# EasyEDA Pro project ProPrj_智能视觉集成板-V2.0.epro, board 母板
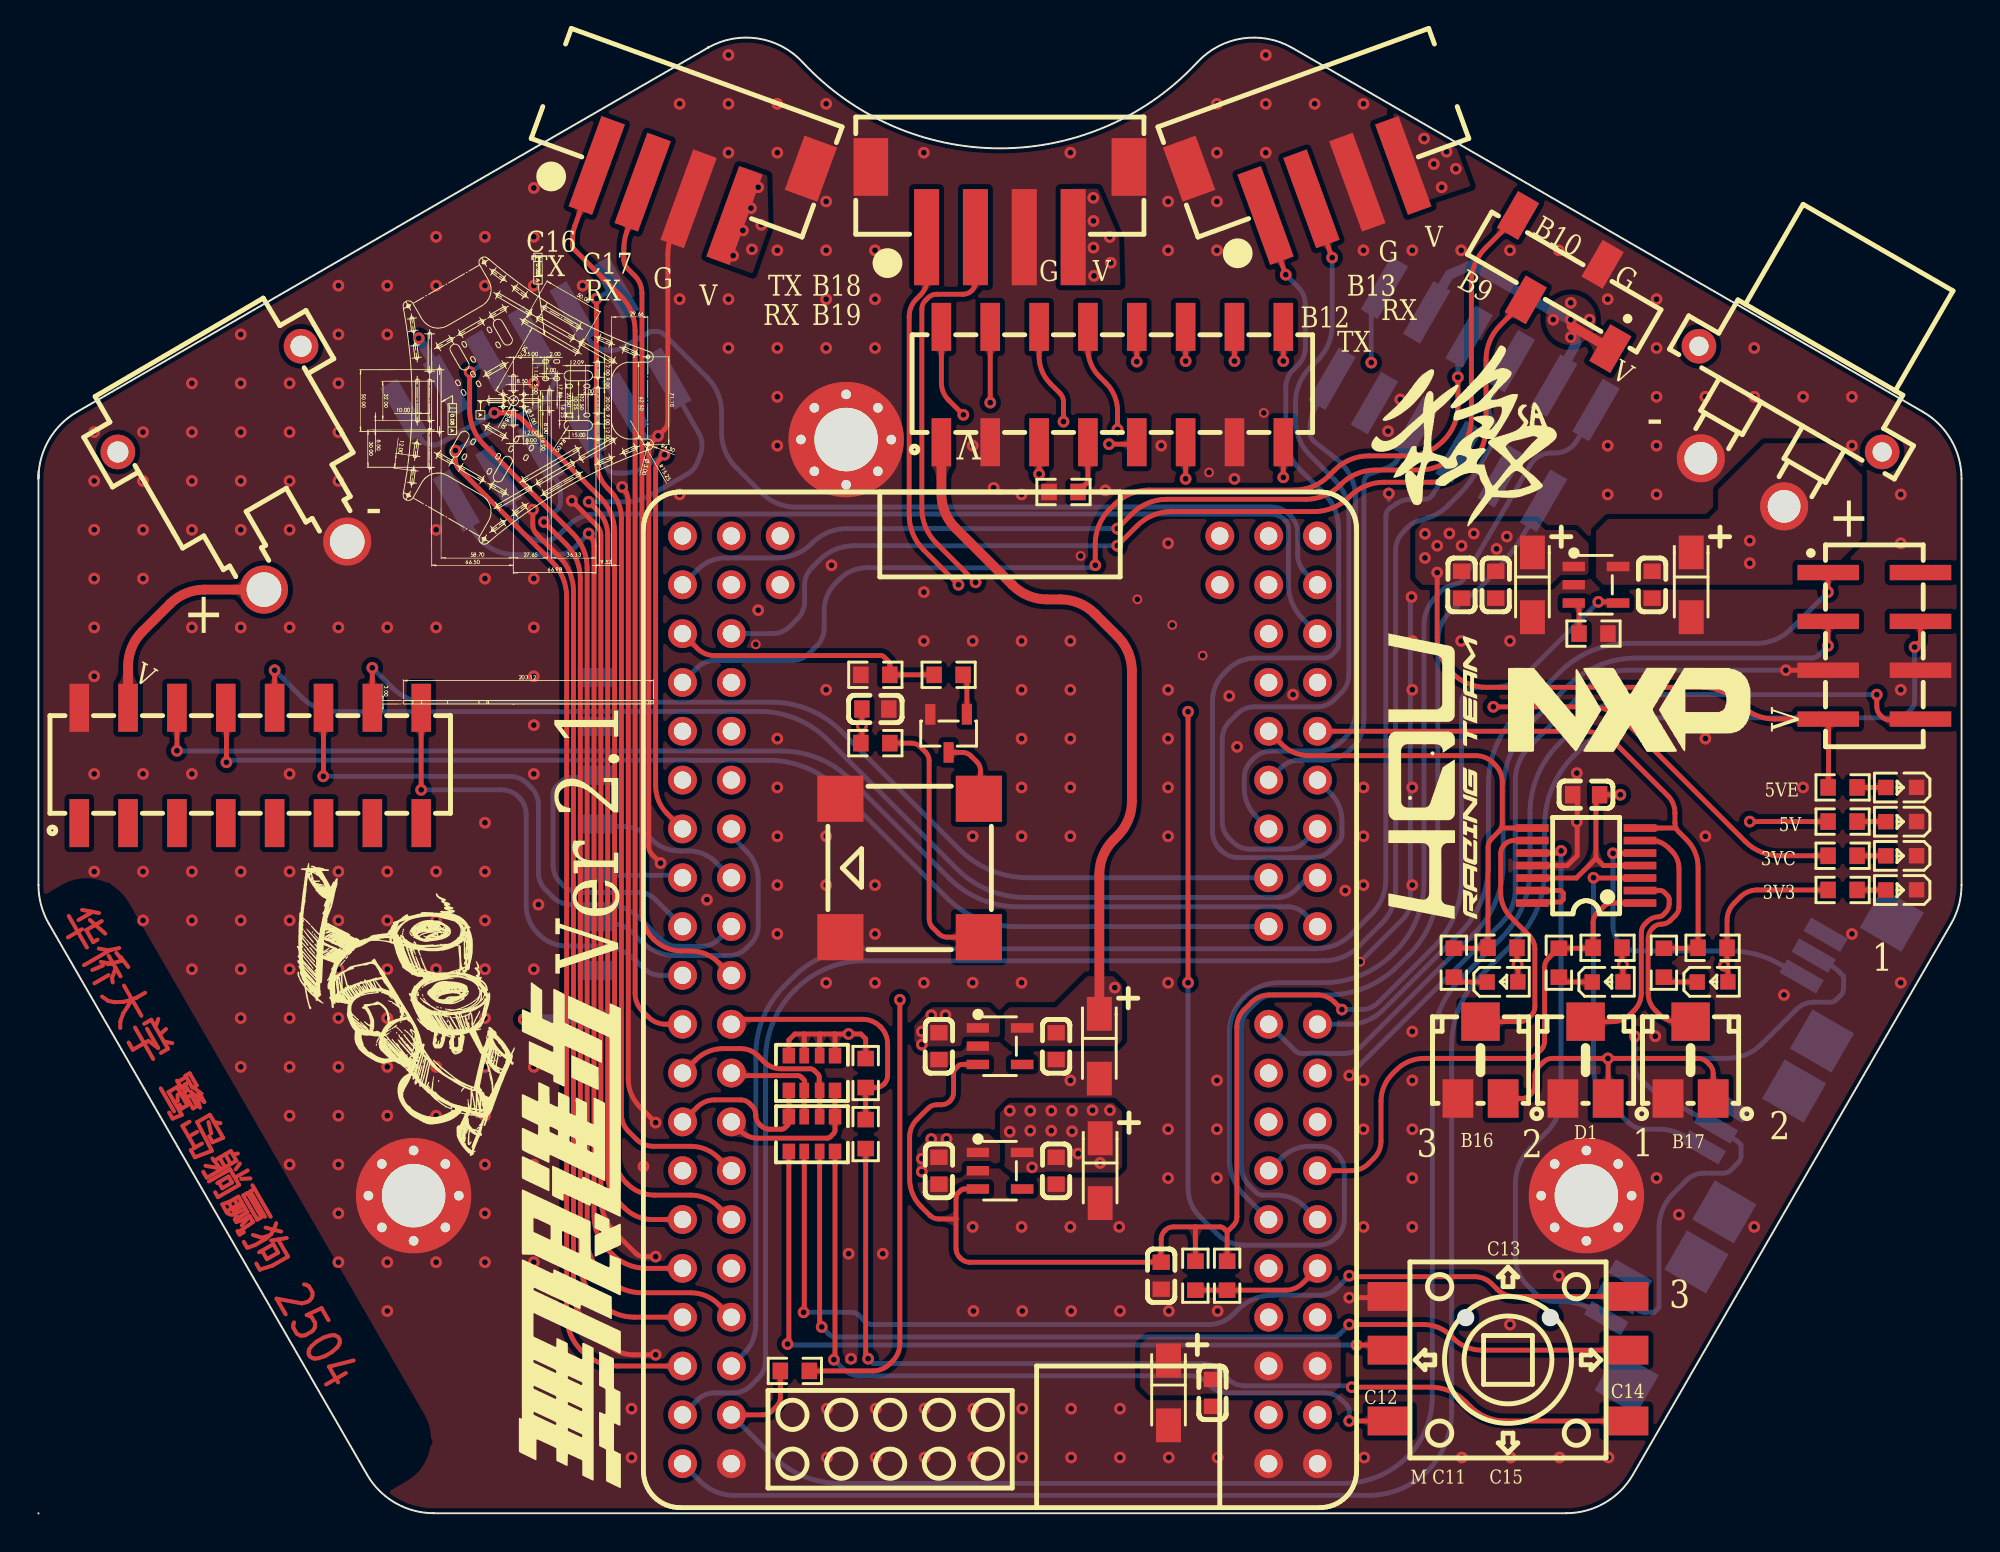
[diagram p17: board, top side]
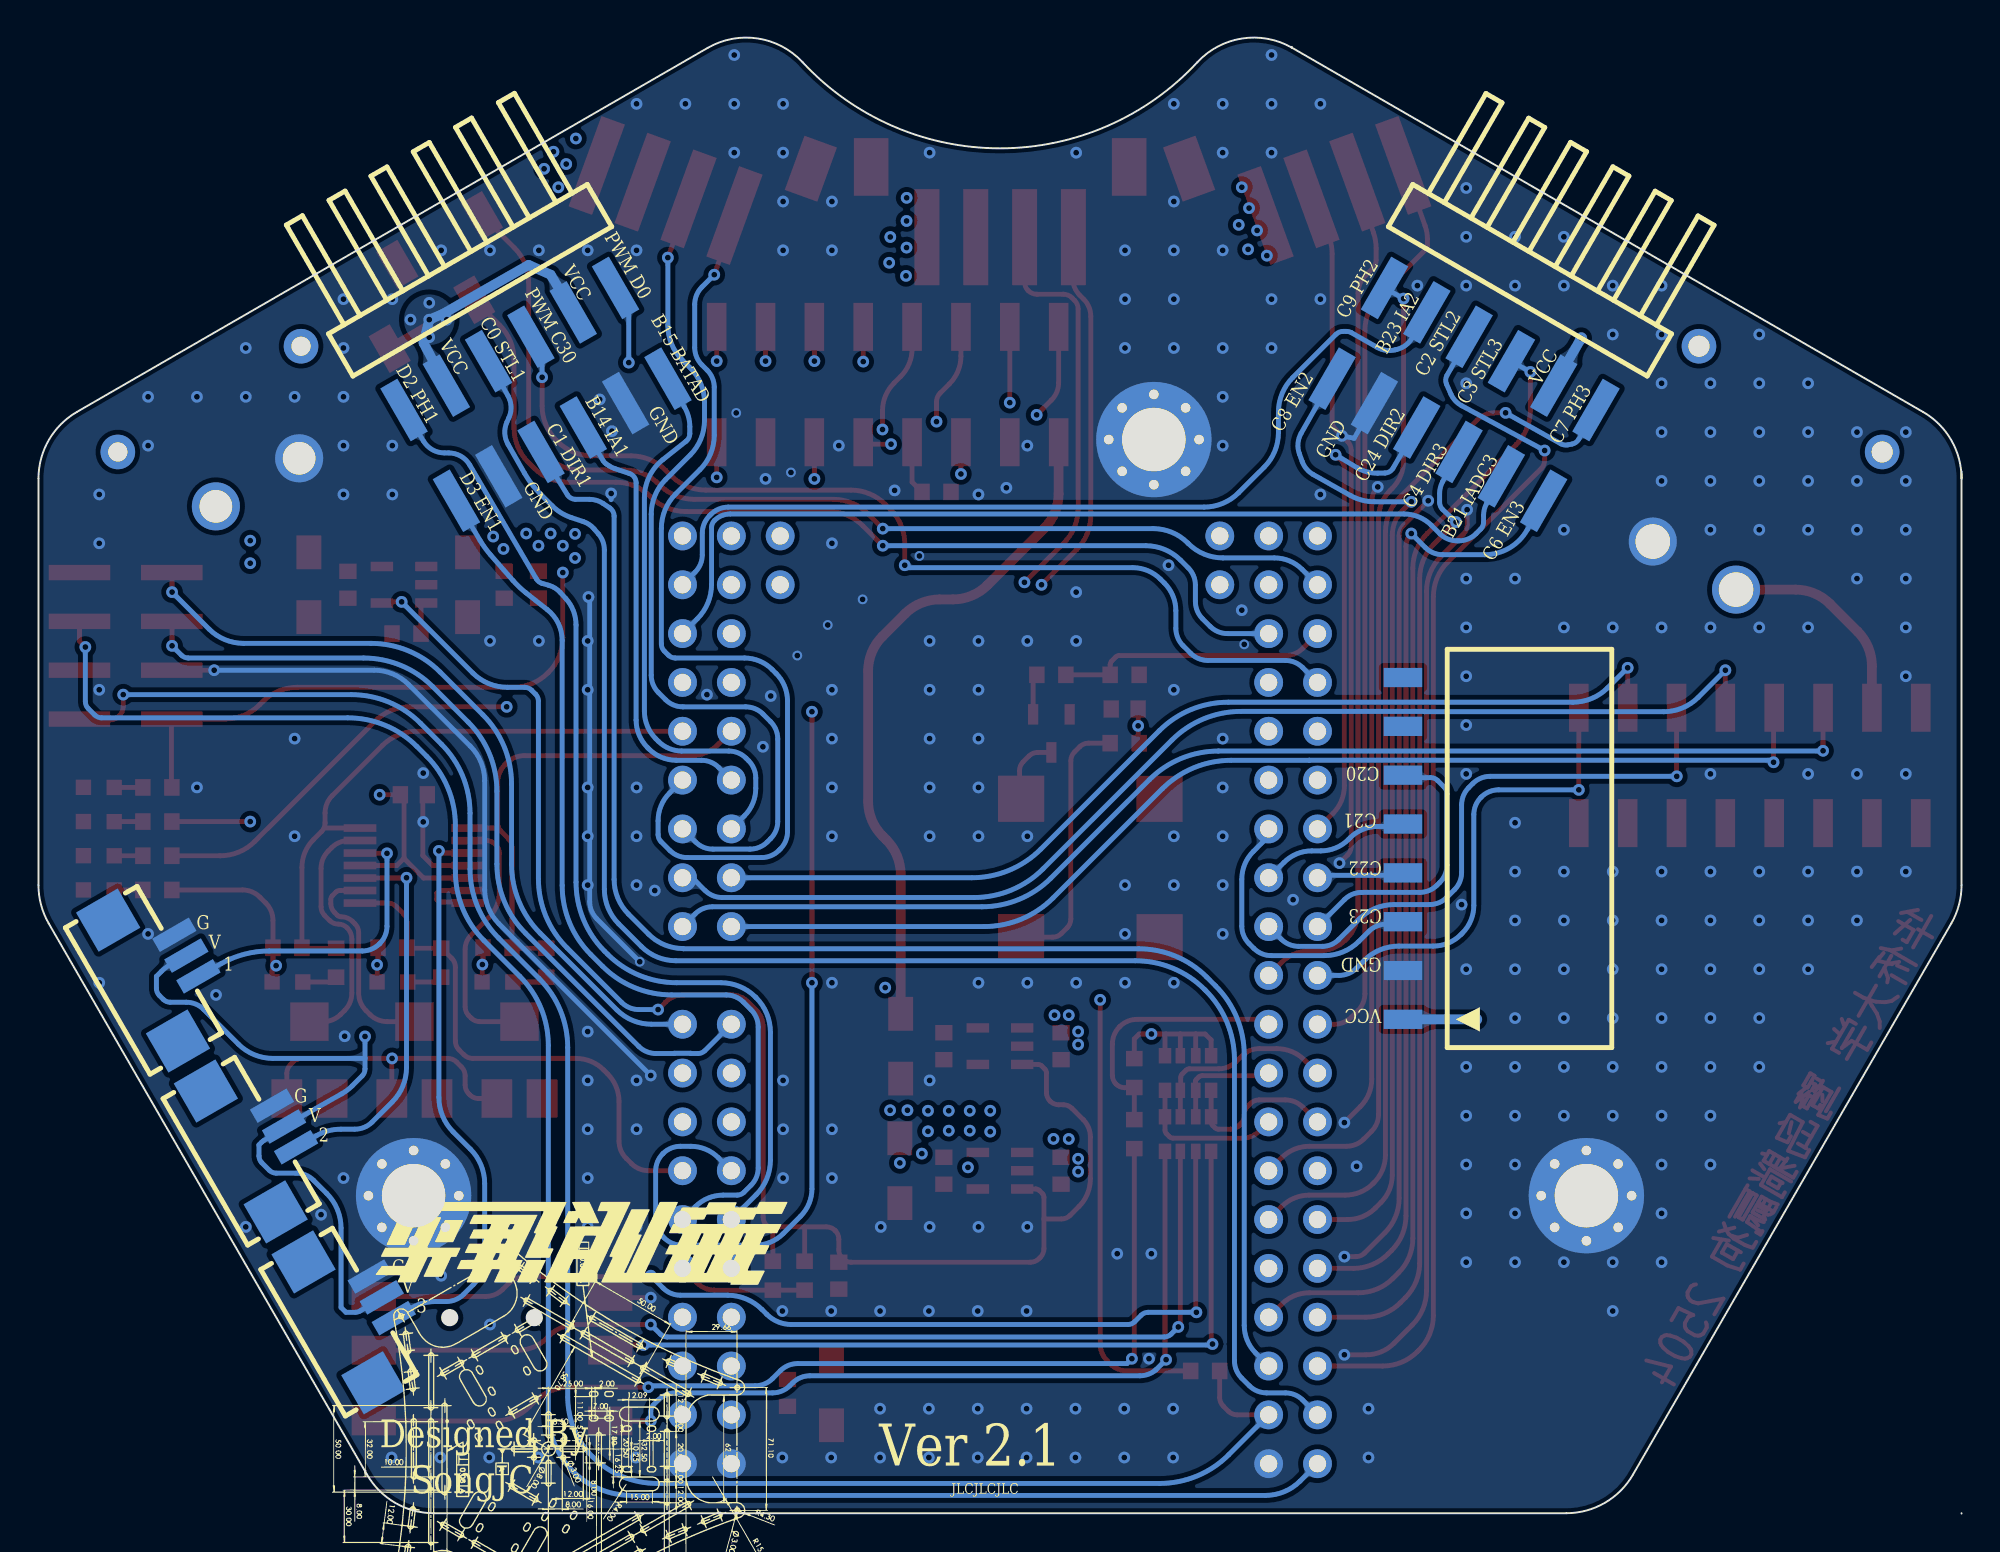
[diagram p18: board, bottom side, seen from below]

Outline 100 x 76.73 mm; copper layers: Top Layer, Inner1, Inner2, Bottom Layer. Coordinates in mm from the lower left corner of the outline.
Outline path: 0,54.21 0,53.84 arc(0.54,55.84) 2,57.3 34.84,76.27 arc(34.84,76.26) 34.82,76.25 arc(37.4,76.73) 39.73,75.5 arc(50,71.02) 60.27,75.5 arc(62.6,76.73) 65.2,76.24 98,57.3 arc(99.46,55.84) 100,53.84 100,32.69 arc(99.86,31.66) 99.46,30.69 82.91,2.02 arc(81.44,0.55) 79.44,0.02 20.56,0.02 arc(18.56,0.55) 17.09,2.02 0.54,30.69 arc(0.14,31.66) 0,32.69 0,54.02 ; 0,0.02 0,0 ; 34.83,76.3 arc(34.83,76.3) 34.83,76.3
Stack: Top Layer 0.035mm 外层铜厚1oz / Dielectric1 0.2104mm 7628 RC49% 8.6mil / Inner1 0.0152mm 内层铜厚 / Dielectric2 1.065mm 1.1mm H/HOZ Copper / Inner2 0.0152mm 内层铜厚 / Dielectric3 0.2104mm 7628 RC49% 8.6mil / Bottom Layer 0.035mm 外层铜厚1oz

## Design rules (mm)
template: 自定义配置
spacing copperThickness1oz (default): track to track 0.102, other pairs 0.102 to 0.3
spacing copperThickness2oz: track to track 0.203, other pairs 0.152 to 0.3
track width copperThickness1oz (default): min 0.127, default 0.254, max 2.54
track width copperThickness2oz: min 0.203, default 0.254, max 2.54
differential pair differentialPair (default): width min 0.127, default 0.254, max 2.54; gap min 0.152, default 0.152
via viaSize (default): diameter min 0.5, default 0.61, max 10; hole min 0.3, default 0.305, max 6.299
net VCC_3V3 uses ZHILIAN
net VCC_5V uses ZHILIAN
net GND_MAIN uses ZHILIAN
net VCC_CSI_3V3 uses ZHILIAN
net VCC_5V_EXT uses ZHILIAN

## Placement (name value [footprint] x y rotation side)
BUZZER2  2.7kHz  [BUZ-SMD_4P-L8.5-W8.5-P8.50-BR]  45.3 33.58 90 top
C1  1uF  [C0603]  61.05 6.28 90 top
C2  10uF  [CAP-SMD_L3.2-W1.6-RD-C7171]  58.76 6.28 270 top
C3  1uF  [C0603]  58.38 12.37 270 top
C4  100nF  [C0603]  46.82 17.83 90 top
C5  100nF  [C0603]  52.92 17.83 90 top
C6  10uF  [CAP-SMD_L3.2-W1.6-RD-C7171]  55.21 17.83 270 top
C7  100nF  [C0603]  46.82 24.31 90 top
C8  100nF  [C0603]  52.92 24.31 90 top
C9  10uF  [CAP-SMD_L3.2-W1.6-RD-C7171]  55.17 24.31 270 top
C10  100nF  [C0603]  74 48.31 90 top
C11  1uF  [C0603]  43.52 41.85 0 top
C12  100nF  [C0603]  80.48 37.39 0 top
C13  10uF  [CAP-SMD_L3.2-W1.6-RD-C7171]  77.69 48.31 270 top
C14  100nF  [C0603]  75.78 48.31 90 top
C15  10uF  [CAP-SMD_L3.2-W1.6-RD-C7171]  85.94 48.31 270 top
C16  100nF  [C0603]  83.91 48.31 90 top
CN6  XT30PW-M30.G.Y  [CONN-TH_XT30PW-M]  11.39 53.64 210 top
CN10  HC-1.25-3PWT  [CONN-SMD_HC-1.25-3PWT]  88.35 19.49 240 bottom
CN11  HC-1.25-3PWT  [CONN-SMD_HC-1.25-3PWT]  93.43 28.38 240 bottom
CN12  HC-1.25-3PWT  [CONN-SMD_HC-1.25-3PWT]  83.27 10.6 240 bottom
J1  -  [M3螺帽]  19.51 16.54 0 top
J3  -  [M3螺帽]  42 55.87 0 top
J4  -  [M3螺帽]  80.49 16.54 0 top
LED1  NCD0603R1  [LED0603-RD_RED]  96.86 37.77 180 top
LED2  NCD0603R1  [LED0603-RD_RED]  96.86 36 180 top
LED3  NCD0603R1  [LED0603-RD_RED]  96.86 32.44 180 top
LED4  NCD0603R1  [LED0603-RD_RED]  96.86 34.22 180 top
LED5  NCD0603R1  [LED0603-RD_RED]  81.59 27.65 0 top
LED6  NCD0603R1  [LED0603-RD_RED]  87.05 27.65 0 top
LED7  NCD0603R1  [LED0603-RD_RED]  76.13 27.65 0 top
Q1  S8050  [SOT-23-3_L2.9-W1.3-P1.90-LS2.3-BR]  47.33 40.58 90 top
R1  10kΩ  [R0603]  61.81 12.37 90 top
R2  0Ω  [R0603]  60.16 12.37 90 top
R3  10kΩ  [R0603]  53.3 53.14 0 top
R4  10kΩ  [R0603]  93.81 36 180 top
R5  10kΩ  [R0603]  93.81 37.77 180 top
R6  4.7kΩ  [R0603]  93.81 32.44 180 top
R7  4.7kΩ  [R0603]  93.81 34.22 180 top
R8  4.7kΩ  [R0603]  80.86 45.77 180 top
R9  10kΩ  [R0603]  39.33 7.42 0 top
R10  4.7kΩ  [R0603]  47.33 43.63 180 top
R11  10kΩ  [R0603]  43.52 43.63 180 top
R12  10Ω  [R0603]  43.52 40.08 0 top
R13  10kΩ  [RES-ADJ-TH_3P-L5.0-W4.5-P2.35-BR]  80.45 23.59 0 top
R14  10kΩ  [R0603]  81.59 29.43 0 top
R15  1kΩ  [R0603]  79.06 28.65 270 top
R16  10kΩ  [RES-ADJ-TH_3P-L5.0-W4.5-P2.35-BR]  85.91 23.59 0 top
R17  10kΩ  [R0603]  87.05 29.43 0 top
R18  1kΩ  [R0603]  84.52 28.65 270 top
R19  10kΩ  [RES-ADJ-TH_3P-L5.0-W4.5-P2.35-BR]  74.99 23.59 0 top
R20  10kΩ  [R0603]  76.13 29.43 0 top
R21  1kΩ  [R0603]  73.6 28.65 270 top
R22  100Ω  [R0603]  43.01 19.74 270 top
R23  1kΩ  [R0603]  43.01 22.91 90 top
RN1  1kΩ  [RES-ARRAY-SMD_0603-8P-L3.2-W1.6-BL]  40.22 22.91 0 top
RN4  100Ω  [RES-ARRAY-SMD_0603-8P-L3.2-W1.6-BL]  40.22 19.74 180 top
SW5  K1-1504SA-06  [SW-SMD_K1-1504SA-06]  76.42 8.06 0 top
tof  X6511WVS-04H-C60D48R1  [HDR-SMD_4P-P2.54-V-M-S4.8]  79.34 64.06 150 top
U56  XT30PW-F20.G.Y  [CONN-TH_XT30PW-F-1]  89.86 55.81 150 top
U58  PZ254-2-06-WS  [HDR-SMD_12P-P2.54_HCTL_PZ254-2-06-WS]  25.87 58.22 30 bottom
U60  HX 2.54-4PIN LTJS  [CONN-SMD_4P-P2.54_HX-2.54-4PIN-LTJS#3]  66.76 70.54 200 top
U63  HX 2.54-4PIN LTJS  [CONN-SMD_4P-P2.54_HX-2.54-4PIN-LTJS]  33.24 70.54 160 top
U64  -  [MIMXRT1064xVL_CoreBoard - 3D]  50 26.72 90 top
U65  RT9013-33GB  [SOT-23-5_L3.0-W1.7-P0.95-LS2.8-BL]  50 17.83 270 top
U66  RT9013-33GB  [SOT-23-5_L3.0-W1.7-P0.95-LS2.8-BL]  50 24.31 270 top
U71  SY6280AAC  [SOT-23-5_L3.0-W1.7-P0.95-LS2.8-BL]  80.99 48.31 270 top
U73  OPA4377  [TSSOP-14_L5.0-W4.4-P0.65-LS6.4-BL]  80.48 33.71 90 top
U74  HX 2.54-4PIN LTJS  [CONN-SMD_4P-P2.54_HX-2.54-4PIN-LTJS#2]  49.99 68.22 180 top
单驱连接  PZ254-2-06-WS  [HDR-SMD_12P-P2.54_HCTL_PZ254-2-06-WS]  74.13 58.22 330 bottom
屏幕  PM254-2-08-S-8.5  [HDR-SMD_16P-P2.54-V-F-R2-C8-LS7.1]  11.01 38.92 0 top
摄像头  PM254-2-08-S-8.5  [HDR-SMD_16P-P2.54-V-F-R2-C8-LS7.1]  55.84 58.73 0 top
无线串口  PM254-2-04-S-8.5  [HDR-SMD_8P-P2.54-V-F-R2-C4-S7.1]  95.47 45.14 270 top
陀螺仪  X6511FRS-08-C85D30  [HDR-SMD_8P-P2.54-H-F-L11.5]  29.04 34.6 90 bottom

## Footprints (pads in the part's own frame, mm; a bottom-side part is the same pattern mirrored in y, then rotated)
BUZ-SMD_4P-L8.5-W8.5-P8.50-BR
  rect 2.4x2.4 smd: 1(-3.6,-3.6) 2(3.6,-3.6) 3(3.599,3.599) 4(-3.6,3.6)
C0603
  rect 0.8x0.9 smd: 1(-0.7,0) 2(0.7,0)
CAP-SMD_L3.2-W1.6-RD-C7171
  rect 1.758x1.296 smd: 1(-1.687,0) 2(1.687,0)
CONN-SMD_4P-P2.54_HX-2.54-4PIN-LTJS
  rect 1.3x5 smd: 1(3.81,1.825) 2(1.27,1.825) 3(-1.27,1.825) 4(-3.81,1.825)
  rect 1.8x3 smd: 5(-6.71,-1.825)
CONN-SMD_4P-P2.54_HX-2.54-4PIN-LTJS#2
  rect 1.3x5 smd: 1(3.81,1.825) 2(1.27,1.825) 3(-1.27,1.825) 4(-3.81,1.825)
  rect 1.8x3 smd: 5(-6.71,-1.825) 6(6.71,-1.825)
CONN-SMD_4P-P2.54_HX-2.54-4PIN-LTJS#3
  rect 1.3x5 smd: 1(3.81,1.825) 2(1.27,1.825) 3(-1.27,1.825) 4(-3.81,1.825)
  rect 1.8x3 smd: 6(6.71,-1.825)
CONN-SMD_HC-1.25-3PWT
  rect 0.8x2.2 smd: 1(-1.25,1.3) 2(0,1.3) 3(1.25,1.3)
  rect 2.35x2.5 smd: 4(-3.63,-1.3) 5(3.63,-1.3)
CONN-TH_XT30PW-F-1
  round 2.5 hole 1.7: 1(-2.5,2.5) 2(2.5,2.5)
  round 1.8 hole 1: 3(5.5,-2.5) 4(-5.5,-2.5)
CONN-TH_XT30PW-M
  round 2.5 hole 1.8: 1(-2.5,5) 2(2.5,5)
  round 1.8 hole 1.1: 3(5.5,-5) 4(-5.5,-5)
HDR-SMD_4P-P2.54-V-M-S4.8
  rect 1.27x2.2 smd: 1(-3.81,1.8) 2(-1.27,-1.8) 3(1.27,1.8) 4(3.81,-1.8)
HDR-SMD_8P-P2.54-H-F-L11.5
  rect 1x2 smd: 1(-8.89,0) 2(-6.35,0) 3(-3.81,0) 4(-1.27,0) 5(1.27,0) 6(3.81,0) 7(6.35,0) 8(8.89,0)
HDR-SMD_8P-P2.54-V-F-R2-C4-S7.1
  rect 0.8x3.2 smd: 1(-3.81,-2.4) 2(-3.81,2.4) 3(-1.27,-2.4) 4(-1.27,2.4) 5(1.27,-2.4) 6(1.27,2.4) 7(3.81,-2.4) 8(3.81,2.4)
HDR-SMD_12P-P2.54_HCTL_PZ254-2-06-WS
  rect 1.02x3.17 smd: 1(-6.35,-2.725) 2(-6.35,2.725) 3(-3.81,-2.725) 4(-3.81,2.725) 5(-1.27,-2.725) 6(-1.27,2.725) 7(1.27,-2.725) 8(1.27,2.725) 9(3.81,-2.725) 10(3.81,2.725) 11(6.35,-2.725) 12(6.35,2.725)
HDR-SMD_16P-P2.54-V-F-R2-C8-LS7.1
  rect 1.02x2.5 smd: 1(-8.89,-3) 2(-8.89,3) 3(-6.35,-3) 4(-6.35,3) 5(-3.81,-3) 6(-3.81,3) 7(-1.27,-3) 8(-1.27,3) 9(1.27,-3) 10(1.27,3) 11(3.81,-3) 12(3.81,3) 13(6.35,-3) 14(6.35,3) 15(8.89,-3) 16(8.89,3)
LED0603-RD_RED
  rect 0.8x0.8 smd: 1(-0.799,-0.004) 2(0.799,0.004)
M3螺帽
  round 6 hole 3.302: 1(0,0)
  round 1 hole 0.5: 2(0,2.349) 3(0,-2.349) 4(2.349,0) 5(-2.349,0) 6(1.651,1.651) 7(-1.651,-1.651) 8(1.651,-1.651) 9(-1.651,1.651)
MIMXRT1064xVL_CoreBoard - 3D
  round 1.5 hole 0.9: 1(-24.13,-16.51) 2(-24.13,-13.97) 3(-21.59,-16.51) 4(-21.59,-13.97) 5(-19.05,-16.51) 6(-19.05,-13.97) 7(-16.51,-16.51) 8(-16.51,-13.97) 9(-13.97,-16.51) 10(-13.97,-13.97) 11(-11.43,-16.51) 12(-11.43,-13.97) 13(-8.89,-16.51) 14(-8.89,-13.97) 15(-6.35,-16.51) 16(-6.35,-13.97) 17(-3.81,-16.51) 18(-3.81,-13.97) 19(-1.27,-16.51) 20(-1.27,-13.97) 23(3.81,-16.51) 24(3.81,-13.97) 25(6.35,-16.51) 26(6.35,-13.97) 27(8.89,-16.51) 28(8.89,-13.97) 29(11.43,-16.51) 30(11.43,-13.97) 31(13.97,-16.51) 32(13.97,-13.97) 33(16.51,-16.51) 34(16.51,-13.97) 35(19.05,-16.51) 36(19.05,-13.97) 37(21.59,-16.51) 38(21.59,-13.97) 39(24.13,-16.51) 40(24.13,-13.97) 41(21.59,-11.43) 42(24.13,-11.43) 43(24.13,11.43) 44(21.59,11.43) 45(24.13,13.97) 46(24.13,16.51) 47(21.59,13.97) 48(21.59,16.51) 49(19.05,13.97) 50(19.05,16.51) 51(16.51,13.97) 52(16.51,16.51) 53(13.97,13.97) 54(13.97,16.51) 55(11.43,13.97) 56(11.43,16.51) 57(8.89,13.97) 58(8.89,16.51) 59(6.35,13.97) 60(6.35,16.51) 61(3.81,13.97) 62(3.81,16.51) 63(1.27,13.97) 64(1.27,16.51) 65(-1.27,13.97) 66(-1.27,16.51) 67(-3.81,13.97) 68(-3.81,16.51) 69(-6.35,13.97) 70(-6.35,16.51) 71(-8.89,13.97) 72(-8.89,16.51) 73(-11.43,13.97) 74(-11.43,16.51) 75(-13.97,13.97) 76(-13.97,16.51) 77(-16.51,13.97) 78(-16.51,16.51) 79(-19.05,13.97) 80(-19.05,16.51) 81(-21.59,13.97) 82(-21.59,16.51) 83(-24.13,13.97) 84(-24.13,16.51)
R0603
  rect 0.806x0.864 smd: 1(-0.753,0) 2(0.753,0)
RES-ADJ-TH_3P-L5.0-W4.5-P2.35-BR
  rect 1.6x2 smd: 1(1.175,-2) 3(-1.175,-2)
  rect 2x2 smd: 2(0,2)
RES-ARRAY-SMD_0603-8P-L3.2-W1.6-BL
  rect 0.65x0.8 smd: 1(-1.2,-0.9) 4(1.2,-0.9) 5(1.2,0.9) 8(-1.2,0.9)
  rect 0.5x0.8 smd: 2(-0.4,-0.9) 3(0.4,-0.9) 6(0.4,0.9) 7(-0.4,0.9)
SOT-23-3_L2.9-W1.3-P1.90-LS2.3-BR
  rect 1.07x0.532 smd: 1(0.99,-0.95) 2(0.99,0.95) 3(-0.99,0)
SOT-23-5_L3.0-W1.7-P0.95-LS2.8-BL
  rect 0.49x1.157 smd: 1(-0.95,-1.153) 2(0,-1.153) 3(0.95,-1.153)
  rect 0.49x1.175 smd: 4(0.95,1.153) 5(-0.95,1.153)
SW-SMD_K1-1504SA-06
  rect 2.3x1.5 smd: 1(-6.15,3.239) 2(-6.15,0.445) 3(-6.15,-3.239) 4(6.15,3.239) 5(6.15,0.445) 6(6.15,-3.239)
TSSOP-14_L5.0-W4.4-P0.65-LS6.4-BL
  rect 0.4x1.7 smd: 1(-1.95,-2.8) 2(-1.3,-2.8) 3(-0.65,-2.8) 4(0,-2.8) 5(0.65,-2.8) 6(1.3,-2.8) 7(1.95,-2.8) 8(1.95,2.8) 9(1.3,2.8) 10(0.65,2.8) 11(0,2.8) 12(-0.65,2.8) 13(-1.3,2.8) 14(-1.95,2.8)

## Nets
As in the schematic, except:
GND_MAIN: BUZZER2.3 BUZZER2.4 C1.1 C2.2 C3.2 C4.1 C5.1 C6.2 C7.1 C8.1 C9.2 C10.1 C11.2 C12.1 C13.2 C14.1 C15.2 C16.1 CN6.1 CN10.1 CN11.1 CN12.1 J1.1 J1.2 J1.3 J1.4 J1.5 J1.6 J1.7 J1.8 J1.9 J3.1 J3.2 J3.3 J3.4 J3.5 J3.6 J3.7 J3.8 J3.9 J4.1 J4.2 J4.3 J4.4 J4.5 J4.6 J4.7 J4.8 J4.9 LED1.1 LED2.1 LED3.1 LED4.1 Q1.2 R3.1 R8.1 R11.2 R13.3 R16.3 R19.3 SW5.1 tof.2 U56.2 U58.10 U60.3 U60.6 U63.3 U63.5 U64.1 U64.2 U64.83 U65.2 U66.2 U71.2 U73.11 U74.3 U74.5 U74.6 单驱连接.4 单驱连接.10 屏幕.2 摄像头.3 摄像头.13 无线串口.5 无线串口.6 陀螺仪.2
$3N3700: R22.2 SW5.6

Pads without a net: CN6 3 4; CN10 4 5; CN11 4 5; CN12 4 5; U56 3 4; U64 3 4 7 8; U65 4; U66 4; 屏幕 1 3 5 7 9 11 13 15; 无线串口 2; 陀螺仪 7 8

## Via types
v1: diameter 0.61, hole 0.305, Top Layer to Bottom Layer, 434 vias
v2: diameter 0.508, hole 0.305, Top Layer to Bottom Layer, 8 vias

## Routing (per net, layer and track width the routed paths; a pad name or vN(x,y) marks a point on that pad's centre or on a via; arc(x,y) is an arc through that point)
GND_MAIN: length 227.3
  Top Layer w0.254: C12.1 80.01,37.16 80.01,34.23 79.5,33.71 U73.11 ; v1(68.16,11.23) 70.2,11.23 SW5.1 ; v1(27.73,52.69) 29.03,51.39 arc(29.19,51.15) 29.25,50.87 29.25,16.4 arc(29.44,15.43) 29.99,14.6 31.04,13.55 arc(31.25,13.41) 31.49,13.36 v1(32.09,13.36) ; v1(90.86,43.87) 无线串口.5 ; v1(25.71,52.22) 25.7,52.21 25.7,51.44 arc(25.76,51.17) 25.91,50.94 27.08,49.77 arc(27.63,48.95) 27.82,47.98 27.82,11.6 arc(28.01,10.63) 28.56,9.81 29.52,8.85 arc(30.18,8.41) 30.95,8.26 v1(32.09,8.26) ; v1(32.35,33.84) 31.92,34.26 arc(31.79,34.47) 31.74,34.71 31.74,55.32 arc(31.79,55.56) 31.92,55.76 v1(32.22,56.06) 32.54,56.38 arc(32.68,56.59) 32.73,56.83 32.73,65.52 arc(32.77,65.96) 32.88,66.39 33.81,68.9 ; v1(32.09,20.34) 31.26,21.17 arc(30.82,21.83) 30.67,22.6 30.67,52.65 arc(30.59,53.06) v1(30.36,53.41)
  Bottom Layer w0.254: v1(32.22,56.06) 31.59,55.93 U58.10 ; v1(68.16,22.79) 76.05,30.68 arc(76.6,31.5) 76.8,32.48 76.8,38.12 arc(76.99,39.09) 77.54,39.91 80.75,43.13 arc(81.58,43.68) 82.55,43.87 v1(90.86,43.87) ; v1(70.22,53.06) 70.22,52.74 ; v1(71.4,47.68) 71.34,47.62 71.34,31.84 arc(71.24,31.35) 70.96,30.94 v2(68.73,28.71)
  vias: v1(2.9,56.26) v1(2.9,53.72) v1(2.9,51.18) v1(2.9,48.64) v1(2.9,46.1) v1(2.9,43.56) v1(2.9,38.48) v1(2.9,33.4) v1(5.44,56.26) v1(5.44,53.72) v1(5.44,51.18) v1(5.44,48.64) v1(5.44,38.48) v1(5.44,33.4) v1(5.44,30.86) v1(7.98,58.8) v1(7.98,56.26) v1(7.98,53.72) v1(7.98,51.18) v1(7.98,46.1) v1(7.98,38.48) v1(7.98,33.4) v1(7.98,30.86) v1(7.98,28.32) v1(10.52,61.34) v1(10.52,58.8) v1(10.52,56.26) v1(10.52,53.72) v1(10.52,51.18) v1(10.52,46.1) v1(10.52,33.4) v1(10.52,30.86) v1(10.52,28.32) v1(10.52,25.78) v1(10.52,23.24) v1(13.06,58.8) v1(13.06,56.26) v1(13.06,53.72) v1(13.06,51.18) v1(13.06,46.1) v1(13.06,38.48) v1(13.06,33.4) v1(13.06,30.86) v1(13.06,28.32) v1(13.06,25.78) v1(13.06,23.24) v1(13.06,20.7) v1(13.06,18.16) v1(15.6,63.88) v1(15.6,61.34) v1(15.6,58.8) v1(15.6,56.26) v1(15.6,53.72) v1(15.6,46.1) v1(15.6,33.4) v1(15.6,30.86) v1(15.6,28.32) v1(15.6,25.78) v1(15.6,23.24) v1(15.6,20.7) v1(15.6,18.16) v1(15.6,15.62) v1(15.6,13.08) v1(18.14,63.88) v1(18.14,61.34) v1(18.14,46.1) v1(18.14,33.4) v1(18.14,30.86) v1(18.14,28.32) v1(18.14,25.78) v1(18.14,23.24) v1(18.14,20.7) v1(18.14,13.08) v1(18.14,10.54) v1(20.68,66.42) v1(20.68,63.88) v1(20.68,51.18) v1(20.68,46.1) v1(20.68,33.4) v1(20.68,30.86) v1(20.68,28.32) v1(20.68,25.78) v1(20.68,23.24) v1(20.68,20.7) v1(20.68,13.08) v1(23.22,66.42) v1(23.22,63.88) v1(23.22,48.64) v1(23.22,35.94) v1(23.22,33.4) v1(23.22,30.86) v1(23.22,28.32) v1(23.22,25.78) v1(23.22,23.24) v1(23.22,20.7) v1(23.22,18.16) v1(23.22,15.62) v1(23.22,13.08) v1(25.76,68.96) v1(25.76,66.42) v1(25.76,63.88) v1(25.76,58.8) v1(25.76,48.64) v1(25.76,46.1) v1(25.76,43.56) v1(25.76,41.02) v1(25.76,38.48) v1(25.76,28.32) v1(25.76,23.24) v1(25.76,20.7) v1(25.76,18.16) v1(25.76,15.62) v1(25.76,13.08) v1(26,31.68) v1(28.3,63.88) v1(30.84,5.46) v1(30.84,2.92) v1(31.46,18.06) v1(33.34,73.33) v1(33.34,63.17) v1(33.34,53.01) v1(34.76,31.93) v1(35.88,75.87) v1(35.88,73.33) v1(35.88,70.79) v1(35.88,63.17) v1(35.88,60.63) v1(37.43,46.99) v1(38.42,73.33) v1(38.42,70.79) v1(38.42,65.71) v1(38.42,60.63) v1(38.42,58.09) v1(38.42,55.55) v1(38.42,40.31) v1(38.42,37.77) v1(38.42,35.23) v1(38.42,32.69) v1(38.42,30.15) v1(40.96,73.33) v1(40.96,68.25) v1(40.96,65.71) v1(40.96,63.17) v1(40.96,60.63) v1(40.96,42.85) v1(40.96,35.23) v1(40.96,32.69) v1(40.96,27.61) v1(41,5.46) v1(41,2.92) v1(41.24,49.33) v1(42.13,13.52) v1(42.25,8.06) v1(43.5,65.71) v1(43.5,63.17) v1(43.5,60.63) v1(43.5,32.69) v1(43.5,30.15) v1(43.5,27.61) v1(43.54,5.46) v1(43.54,2.92) v1(43.9,13.52) v1(46.04,70.79) v1(46.04,47.93) v1(46.04,45.39) v1(46.04,27.61) v1(46.08,5.46) v1(46.08,2.92) v1(48.58,55.55) v1(48.58,45.39) v1(48.58,35.23) v1(48.58,27.61) v1(48.58,14.91) v1(48.62,10.54) v1(48.62,5.46) v1(48.62,2.92) v1(49.67,53.36) v1(51.12,53.01) v1(51.12,45.39) v1(51.12,42.85) v1(51.12,40.31) v1(51.12,37.77) v1(51.12,35.23) v1(51.12,27.61) v1(51.12,14.91) v1(51.16,10.54) v1(51.16,5.46) v1(51.16,2.92) v1(53.66,70.79) v1(53.66,45.39) v1(53.66,42.85) v1(53.66,40.31) v1(53.66,37.77) v1(53.66,35.23) v1(53.66,22.53) v1(53.66,14.91) v1(53.7,10.54) v1(53.7,5.46) v1(53.7,2.92) v1(55.48,53.22) v1(56.2,14.91) v1(56.24,10.54) v1(56.24,5.46) v1(56.24,2.92) v1(58.38,55.55) v1(58.74,68.25) v1(58.74,65.71) v1(58.74,50.47) v1(58.74,42.85) v1(58.74,40.31) v1(58.74,37.77) v1(58.74,35.23) v1(58.74,27.61) v1(58.74,19.99) v1(58.74,17.45) v1(58.78,10.54) v1(58.78,2.92) v1(61.28,73.33) v1(61.28,70.79) v1(61.28,68.25) v1(61.28,65.71) v1(61.28,22.53) v1(61.28,19.99) v1(61.28,17.45) v1(61.32,10.54) v1(61.32,2.92) v1(61.92,42.53) v1(62.19,53.82) v1(62.33,39.89) v1(63.82,75.87) v1(63.82,73.33) v1(63.82,70.79) v1(65.24,42.6) v1(66.36,73.33) v1(67.95,32.41) v1(68.9,73.33) v1(68.9,65.71) v1(68.9,37.77) v1(68.9,35.23) v1(68.9,32.69) v1(68.9,22.53) v1(68.9,19.99) v1(68.9,14.91) v1(68.94,2.92) v1(70.18,56.3) v1(70.81,57.96) v1(71.44,65.71) v1(71.44,45.39) v1(71.44,42.85) v1(71.44,37.77) v1(71.44,35.23) v1(71.44,32.69) v1(71.44,25.07) v1(71.44,22.53) v1(71.44,19.99) v1(71.44,17.45) v1(71.44,14.91) v1(73.98,65.71) v1(73.98,45.39) v1(74.02,2.92) v1(76.52,65.71) v1(76.52,45.39) v1(76.52,9.83) v1(76.56,2.92) v1(79.06,65.71) v1(79.06,12.37) v1(79.1,2.92) v1(79.99,38.52) v1(79.99,35.98) v1(81.6,63.17) v1(81.6,55.55) v1(81.6,53.01) v1(81.64,2.92) v1(84.14,63.17) v1(84.14,60.63) v1(84.14,58.09) v1(84.14,55.55) v1(84.14,53.01) v1(84.08,24.83) v1(84.14,17.45) v1(85.31,15.55) v1(86.68,58.09) v1(86.68,40.31) v1(86.68,35.23) v1(89.22,60.63) v1(89.22,58.09) v1(89.22,14.91) v1(90.77,26.98) v1(91.76,58.09) v1(91.76,37.77) v1(94.3,58.09) v1(94.3,55.55) v1(94.3,30.15) v1(96.84,53.01) v1(96.84,50.47) v1(96.84,42.85) v1(96.84,27.61) v2(37.3,45.22) v2(54.19,49.81) v2(57.14,47.56) v2(58.96,46.22) v2(60.54,44.63) v2(60.87,54.16) v2(63.72,57.25)
VCC_3V3: length 346.4
  Top Layer w0.254: 76.93,27.66 76.93,28.55 v1(76.92,28.56) 76.88,28.59 R20.2 ; R12.1 42.82,40.13 v1(42.82,40.98) C11.1 ; 40.63,24.95 39.82,24.95 ; 40.63,24.95 41.38,24.95 ; 40.63,24.95 40.62,24.94 40.62,23.81 ; 39.82,24.95 39.82,24.94 39.82,23.81 ; 39.82,24.95 39.33,24.95 39.02,24.64 39.02,23.81 ; U73.4 81.37,33.71 80.99,34.09 ; 87.81,28.59 87.81,30.86 arc(87.9,31.34) 88.18,31.76 88.49,32.07 arc(88.9,32.34) 89.39,32.44 R6.2 ; 41.38,24.95 41.42,24.91 41.42,23.81 ; 41.38,24.95 v1(42.13,24.95) 42.76,24.95 43.01,24.69 R23.2 ; v1(81.61,23.68) 78.71,23.68 arc(78.47,23.63) 78.26,23.49 78,23.23 arc(77.86,23.02) 77.81,22.78 77.81,22.29 arc(77.76,22.05) 77.63,21.84 77.56,21.78 arc(77.36,21.64) 77.11,21.59 R19.1 ; v1(81.61,23.68) 86.31,23.68 arc(86.56,23.63) 86.76,23.49 86.9,23.35 arc(87.04,23.15) 87.09,22.9 R16.1 ; v1(81.61,23.68) 81.62,23.67 R13.1 ; 87.85,28.29 LED6.2 ; U73.12 79.97,33.06 80.99,34.08 80.99,34.09 ; 80.99,34.09 80.99,37.2 C12.2 v1(82.26,37.39) ; v1(44.79,26.72) 44.79,8.84 arc(44.7,8.35) 44.42,7.94 44.28,7.79 arc(43.86,7.52) 43.38,7.42 R9.2 ; LED5.2 v1(82.39,28.55) 82.35,28.59 R14.2
  Top Layer w0.508: CN6.2 8.64,48.06 arc(7.66,47.87) 6.84,47.32 5.41,45.88 arc(4.85,45.06) 4.66,44.09 屏幕.4 ; 81.74,60.6 79.72,61.78
  Inner2 w0.254: v1(42.82,40.98) 42.82,36.9 42.83,36.88 ; v1(81.61,23.68) 81.61,28.5 ; 84.42,28.5 84.42,35.23 v1(82.26,37.39)
  Inner2 w0.508: 42.07,26.72 29.55,26.72 28.54,25.71 v1(25.23,25.71) ; 42.07,26.72 42.07,25.01 v1(42.13,24.95) ; 42.07,26.72 v1(44.79,26.72) 49.24,26.72 50.51,25.45 v1(50.51,20.95) ; v1(19.77,61.14) 18.65,60.02 18.65,48.06 ; 18.65,48.06 CN6.2 ; 18.65,48.06 21.3,48.06 23.58,45.77 23.58,38.92 25.62,36.88 50.51,36.88 52.67,34.73 v1(52.67,20.95) ; 83.02,28.26 v1(83.02,24.82) ; 84.42,28.5 v1(87.64,28.5)
  Inner2 w1.27: 79.68,61.19 79.68,40.02 75.31,35.65 75.31,28.5 ; 75.31,28.5 84.42,28.5 ; 75.31,28.5 73.88,28.5 72.73,27.36 62.09,27.36 v1(55.72,20.98)
  Bottom Layer w0.254: 83.02,23.68 v1(83.02,24.82) ; 83.02,23.68 87.81,23.68 arc(88.78,23.87) 89.61,24.42 91.41,26.23 arc(91.82,26.5) 92.31,26.6 93.15,26.6 arc(93.34,26.64) 93.51,26.75 93.72,26.96 arc(93.83,27.12) 93.87,27.32 93.87,27.94 93.59,28.22 arc(93.39,28.4) 93.15,28.55 CN11.2 ; 83.02,23.68 83.02,23.13 arc(83.06,22.93) 83.17,22.77 83.68,22.25 arc(83.94,22.03) 84.23,21.84 CN10.2 87.25,20.04 88.3,19.39 arc(88.35,19.36) 88.4,19.32 88.53,19.18 88.53,18.61 arc(88.49,18.41) 88.38,18.25 88,17.86 arc(87.83,17.75) 87.64,17.71 86.59,17.71 arc(86.11,17.61) 85.7,17.34 85.01,16.65 arc(84.46,15.83) 84.27,14.85 84.27,10.72 84.01,10.47 83.53,10.47 arc(83.41,10.49) 83.28,10.53 82.17,11.16 CN12.2
  Bottom Layer w0.508: v1(19.77,61.14) U58.3 ; 72.19,62.49 73.37,64.44 74.51,64.95 78.96,62.41 v1(79.68,62.1) 79.97,60.89 单驱连接.9 ; 陀螺仪.1 v1(25.23,25.71)
  vias: v1(50.51,19.87) v1(51.57,20.95) v1(51.57,19.92) v1(51.67,18.01) v1(52.67,19.92) v1(53.75,20.95) v1(53.75,19.89) v1(54.06,18.72) v1(54.81,20.98) v1(55.21,18.24) v1(78.77,62.11) v1(79.68,62.98) v1(79.68,61.19) v1(80.66,62.11)
VCC_5V: length 105.1
  Top Layer w0.254: R4.2 v1(88.99,36)
  Inner2 w0.508: v1(47.22,19.49) 45.97,19.49 45.94,19.52 ; 45.94,25.44 v1(46.43,25.93) v1(47.17,25.93)
  Inner2 w1.27: v1(45.94,25.07) v1(45.94,24.4) v1(45.94,18.46) v1(45.94,17.79) 45.94,11.48 49.75,7.67 U64.6 U64.5 80.99,7.67 83.99,10.68 88.99,19.1 v1(88.99,36) v1(88.99,49.44) v1(88.99,50.61) U56.1
  vias: v1(46.43,19.48)
VCC_5V_EXT: length 89.9
  Top Layer w0.254: 93.09,37.82 93.09,41.31 无线串口.7 90.29,41.33 arc(89.32,41.52) 88.5,42.07 88.34,42.24 arc(87.51,42.79) 86.54,42.98 75.31,42.98 arc(74.34,43.17) 73.51,43.72 73.48,43.76 arc(72.93,44.58) 72.73,45.56 v1(72.73,48.95)
  Inner2 w1.27: 72.72,61.9 72.72,50.36 v1(72.73,50.35) ; 72.72,61.9 72.59,61.78 54.88,61.78 ; 72.72,61.9 72.68,70.08 v1(72.56,70.2) ; 54.88,61.78 39.78,61.78 v1(36.12,65.44) ; 54.88,61.78 v1(54.89,64.38)
  vias: v1(36.63,66.75) v1(37.05,67.91) v1(37.1,65.76) v1(37.43,68.99) v1(37.59,67.04) v1(54.85,68.44) v1(54.86,67.24) v1(54.86,65.85) v1(55.71,66.41) v1(55.76,65.07) v1(72.05,71.53) v1(72.1,50.96) v1(72.1,49.71) v1(72.97,68.99) v1(73.22,70.84) v1(73.37,50.98) v1(73.71,69.95) v1(74,50.35) v1(74.64,50.98) v1(75.82,50.18) v1(76.35,50.82)
VCC_CSI_3V3: length 87.3
  Top Layer w0.254: v1(75.65,41.96) 80.7,41.96 arc(81.67,41.77) 82.49,41.22 88.75,34.96 arc(89.58,34.41) 90.55,34.22 R7.2
  Top Layer w0.508: C9.1 55.17,33.25 arc(55.36,34.22) 55.91,35.05 56.11,35.25 arc(56.66,36.08) 56.86,37.05 56.86,43.83 arc(56.66,44.81) 56.11,45.63 54.94,46.81 arc(54.11,47.36) 53.14,47.55 52.45,47.55 arc(51.48,47.75) 50.65,48.3 47.7,51.25 arc(47.15,52.08) 46.95,53.05 摄像头.1
  Inner2 w0.254: v1(75.65,41.96) 74.38,41.96 73.5,41.08 73.5,31.84 arc(73.3,30.87) 72.75,30.04 72.72,30.01 arc(71.89,29.46) 70.92,29.26 58.93,29.26 arc(57.95,29.07) 57.13,28.52 v1(55.97,27.36)
ADC1: length 20
  Top Layer w0.254: U73.3 80.88,33.06 v1(80.86,33.07)
  Bottom Layer w0.254: v1(80.86,33.07) 80.86,23.2 arc(81.05,22.23) 81.6,21.41 82.65,20.37 arc(83.06,20.09) 83.55,19.99 84.28,19.99 arc(84.93,19.91) 85.54,19.66 CN10.3
ADC2: length 16
  Top Layer w0.254: U73.5 83.26,34.34 v1(81.88,34.34)
  Bottom Layer w0.254: v1(81.88,34.34) 81.88,30.55 arc(81.97,30.07) 82.25,29.65 82.27,29.64 arc(82.68,29.36) 83.16,29.26 88,29.26 arc(89.28,29.1) 90.48,28.62 CN11.3
ADC3: length 29.7
  Top Layer w0.254: v1(79.18,34.47) 79.06,34.36 U73.10
  Bottom Layer w0.254: v1(79.18,34.47) 79.18,21.65 arc(78.98,20.68) 78.43,19.85 77.54,18.96 arc(76.99,18.14) 76.8,17.16 76.8,13.34 arc(76.95,12.56) 77.39,11.91 77.9,11.4 arc(78.31,11.13) 78.79,11.03 79.35,11.03 arc(80.01,10.94) 80.63,10.68 CN12.3
B0: length 64.8
  Top Layer w0.254: v1(7.2,39.68) 屏幕.6
  Bottom Layer w0.254: v1(7.2,39.68) 7.21,39.67 38.64,39.67 arc(40.58,39.28) 42.23,38.18 47.36,33.05 arc(49,31.95) 50.95,31.56 64.96,31.56 arc(65.44,31.47) 65.85,31.19 U64.23
B1: length 60.2
  Top Layer w0.254: v1(9.78,39.08) 9.78,41.88 屏幕.8
  Bottom Layer w0.254: v1(9.78,39.08) 9.88,39.19 33.91,39.19 33.92,39.18 37.98,39.18 arc(39.92,38.8) 41.57,37.7 47.24,32.02 arc(48.89,30.92) 50.83,30.53 U64.24
B2: length 60.9
  Top Layer w0.254: v1(12.28,43.87) 屏幕.10
  Bottom Layer w0.254: U64.25 66.21,33.07 arc(66.02,33.04) 65.85,32.93 65.34,32.42 arc(64.93,32.14) 64.45,32.05 51.35,32.05 arc(49.41,32.43) 47.76,33.53 41.06,40.24 arc(39.41,41.34) 37.47,41.73 27.93,41.73 27.91,41.71 15.49,41.71 arc(14.52,41.9) 13.7,42.45 v1(12.28,43.87)
B3: length 52.7
  Top Layer w0.254: v1(17.36,44) 屏幕.14
  Bottom Layer w0.254: U64.26 51.47,33.07 arc(49.52,33.46) 47.88,34.56 41.72,40.72 arc(40.07,41.82) 38.13,42.21 20.2,42.21 arc(19.23,42.4) 18.41,42.95 v1(17.36,44)
B9: length 52
  Top Layer w0.254: v1(56.1,50.35) 57.13,51.38 arc(57.95,51.93) 58.93,52.12 66.35,52.12 arc(67.32,52.32) 68.14,52.87 68.18,52.9 arc(69,53.46) 69.97,53.65 72.44,53.65 arc(73.41,53.84) 74.24,54.39 74.53,54.68 arc(75.08,55.51) 75.27,56.48 75.27,60.02 arc(75.47,60.99) 76.02,61.82 77.34,63.14
  Bottom Layer w0.254: U64.49 38.17,45.77 arc(38.66,45.87) 39.07,46.15 39.47,46.55 arc(39.74,46.96) 39.84,47.44 39.84,48.3 arc(39.94,48.78) 40.21,49.19 40.62,49.6 arc(41.44,50.15) 42.42,50.35 v1(56.1,50.35)
B10: length 55.8
  Top Layer w0.254: tof.4 75.25,65.84 arc(74.7,65.02) 74.51,64.05 74.51,56.99 arc(74.32,56.01) 73.77,55.19 73.6,55.03 arc(72.78,54.48) 71.81,54.28 69.52,54.28 arc(68.55,54.09) 67.73,53.54 67.69,53.5 arc(66.87,52.95) 65.9,52.76 58.67,52.76 arc(57.7,52.57) 56.88,52.02 v1(56.1,51.24)
  Bottom Layer w0.254: U64.48 34.29,49.12 arc(34.95,49.56) 35.73,49.71 38.41,49.71 arc(39.38,49.9) 40.2,50.46 40.24,50.49 arc(41.06,51.04) 42.03,51.24 v1(56.1,51.24)
B12: length 50.2
  Top Layer w0.254: 63.81,67.39 v1(64.86,64.44)
  Bottom Layer w0.254: U64.29 67.19,37.48 arc(67.63,36.82) 67.78,36.04 67.78,35.32 arc(67.74,35.12) 67.63,34.96 67.17,34.5 arc(66.76,34.22) 66.27,34.12 62.4,34.12 arc(61.91,34.22) 61.5,34.5 61.42,34.57 arc(61.15,34.98) 61.05,35.47 61.05,42.27 arc(61.2,43.04) 61.64,43.7 61.85,43.91 arc(62.51,44.35) 63.29,44.5 66.89,44.5 arc(67.08,44.54) 67.25,44.65 67.46,44.87 arc(67.57,45.03) 67.61,45.23 67.61,51.24 arc(67.42,52.21) 66.87,53.04 65.6,54.3 arc(65.05,55.13) 64.86,56.1 64.86,58.58 arc(64.96,59.07) 65.23,59.48 65.5,59.75 arc(65.78,60.17) 65.88,60.65 65.88,62.9 arc(65.78,63.39) 65.5,63.8 v1(64.86,64.44)
B13: length 45.1
  Top Layer w0.254: 66.19,68.26 v1(67.27,65.33)
  Bottom Layer w0.254: v1(67.27,65.33) 67.27,61.81 arc(67.08,60.84) 66.53,60.02 66.11,59.6 arc(65.56,58.78) 65.37,57.8 65.37,56.86 arc(65.56,55.89) 66.11,55.06 67.39,53.78 arc(67.94,52.96) 68.14,51.99 68.14,43.61 arc(68.04,43.12) 67.76,42.71 67.39,42.34 arc(66.98,42.06) 66.49,41.96 63.23,41.96 arc(62.74,41.87) 62.33,41.59 61.93,41.19 arc(61.65,40.78) 61.56,40.3 61.56,36.01 arc(61.65,35.52) 61.93,35.11 62.1,34.93 arc(62.51,34.66) 63,34.56 64.93,34.56 arc(65.42,34.66) 65.83,34.93 U64.27
B14: length 23
  Bottom Layer w0.254: 单驱连接.6 70.63,54.76 arc(70.56,54.67) 70.48,54.6 70.33,54.51 arc(70.19,54.42) 70.03,54.36 69.27,54.1 arc(69.02,53.92) 68.92,53.62 68.92,41.28 arc(68.77,40.5) 68.33,39.85 68.26,39.78 arc(67.6,39.34) 66.82,39.18 65.53,39.18 arc(65.04,39.09) 64.63,38.81 U64.30
B15: length 29.4
  Bottom Layer w0.254: U64.28 63.29,36.29 arc(62.85,36.95) 62.7,37.73 62.7,38.26 arc(62.8,38.75) 63.07,39.16 63.2,39.29 arc(63.62,39.57) 64.1,39.67 66.54,39.67 arc(67.2,39.8) 67.76,40.17 67.9,40.3 arc(68.34,40.96) 68.49,41.74 68.49,52.83 arc(68.24,53.94) 67.53,54.82 66.32,55.78 arc(66.18,55.96) 66.13,56.18 66.13,56.53 arc(66.2,57.06) 66.4,57.55 单驱连接.2
B16: length 25.6
  Top Layer w0.254: U73.8 76.12,35.66 ; R21.1 75.35,29.41 R20.1 75.38,34.66 arc(75.43,34.9) 75.56,35.11 75.93,35.47 arc(76.07,35.68) 76.12,35.92 76.12,38.05 arc(76.02,38.54) 75.75,38.95 75.65,39.05 arc(75.23,39.33) 74.75,39.42 66.08,39.42 arc(65.3,39.58) 64.65,40.02 U64.32
B17: length 31.5
  Top Layer w0.254: R18.1 86.28,29.41 R17.1 86.3,33.62 arc(86.15,34.39) 85.7,35.05 85.28,35.47 arc(85.15,35.68) 85.1,35.92 85.1,36.45 arc(85,36.93) 84.72,37.34 82.12,39.95 arc(81.29,40.5) 80.32,40.69 U64.31 ; U73.7 85.1,35.66
B18: length 36.2
  Top Layer w0.254: 47.82,48.34 46.02,50.13 arc(45.47,50.96) 45.28,51.93 45.28,62.27 arc(45.37,62.76) 45.65,63.17 45.85,63.37 arc(46.12,63.78) 46.22,64.27 46.22,65.5
  Inner2 w0.254: v1(47.84,48.31) 48.23,47.92 arc(48.64,47.65) 49.13,47.55 54.75,47.55 arc(56.7,47.17) 58.35,46.06 60.43,43.98 arc(61.26,43.43) 62.23,43.23 U64.34
B19: length 40.7
  Top Layer w0.254: v1(48.73,48.44) 46.68,50.49 arc(46.13,51.32) 45.94,52.29 45.94,62.66 arc(45.98,62.9) 46.12,63.11 46.26,63.24 arc(46.46,63.38) 46.71,63.43 48.09,63.43 arc(48.33,63.48) 48.53,63.61 arc(48.67,63.82) 48.72,64.06 48.72,66.4
  Inner2 w0.254: U64.33 65.61,44.13 arc(65.2,44.41) 64.71,44.5 62.48,44.5 arc(61.51,44.7) 60.69,45.25 58.98,46.95 arc(57.33,48.05) 55.39,48.44 v1(48.73,48.44)
B20: length 10.6
  Top Layer w0.254: v1(64.73,53.9) 摄像头.15
  Inner2 w0.254: v1(64.73,53.9) 65.05,53.58 arc(65.19,53.37) 65.24,53.13 65.24,47.57 arc(65.14,47.08) 64.87,46.67 U64.36
B21: length 50
  Bottom Layer w0.254: U64.35 65.74,46.54 arc(65.19,47.37) 65,48.34 65,51.3 arc(64.96,51.49) 64.85,51.66 arc(64.47,51.91) 64.02,52 29,52 arc(28.22,51.84) 27.56,51.4 27.13,50.97 arc(26.72,50.7) 26.23,50.6 26.14,50.6 arc(25.66,50.7) 25.24,50.97 25,51.21 arc(24.89,51.38) 24.85,51.57 24.85,51.93 arc(24.81,52.24) 24.7,52.53 23.93,53.96
B22: length 19.7
  Top Layer w0.254: v1(52.03,54.08) 摄像头.5
  Inner2 w0.254: v1(52.03,54.08) 57.55,54.08 arc(58.04,53.98) 58.45,53.71 59.03,53.13 arc(59.3,52.72) 59.4,52.23 59.4,48.46 arc(59.49,47.97) 59.77,47.56 60.04,47.29 arc(60.45,47.01) 60.94,46.92 62.05,46.92 arc(62.53,47.01) 62.94,47.29 U64.38
B23: length 48
  Bottom Layer w0.254: 27.81,62.49 28.57,61.16 arc(28.9,60.78) 29.36,60.56 29.45,60.54 arc(29.93,60.51) 30.39,60.66 31.73,61.43 arc(31.85,61.48) 31.98,61.49 32.16,61.49 arc(32.36,61.46) 32.52,61.35 34.78,59.09 arc(35.33,58.27) 35.52,57.3 35.52,56.22 arc(35.72,55.25) 36.27,54.43 37.6,53.1 arc(38.42,52.55) 39.39,52.35 64.13,52.35 arc(64.62,52.26) 65.03,51.98 65.11,51.9 arc(65.38,51.49) 65.48,51 65.48,49.87 arc(65.58,49.38) 65.85,48.97 U64.37
B24: length 26.7
  Top Layer w0.254: 摄像头.2 46.95,58.82 arc(47.05,58.34) 47.32,57.92 v1(48.09,57.15)
  Inner2 w0.254: U64.40 63.52,51.3 arc(63.38,51.51) 63.34,51.75 63.34,56.17 arc(63.24,56.66) 62.96,57.07 62.82,57.21 arc(62.41,57.49) 61.92,57.59 51.41,57.59 arc(51.16,57.54) 50.96,57.4 50.9,57.34 arc(50.69,57.2) 50.45,57.15 v1(48.09,57.15)
B25: length 27.1
  Top Layer w0.254: v1(49.49,57.79) 摄像头.4
  Inner2 w0.254: U64.39 66.51,55.39 arc(66.32,56.36) 65.77,57.19 65.65,57.3 arc(64.83,57.85) 63.86,58.04 49.75,58.04 v1(49.49,57.79)
B26: length 18.7
  Top Layer w0.254: 摄像头.6 52.03,60.21 arc(52.19,59.43) 52.63,58.77 53.12,58.28 arc(53.25,58.07) 53.3,57.83 v1(53.3,56.8)
  Inner2 w0.254: U64.42 61.43,54.5 arc(61.24,55.47) 60.69,56.3 60.67,56.31 arc(59.85,56.86) 58.88,57.05 53.56,57.05 v1(53.3,56.8)
B27: length 17.8
  Top Layer w0.254: v1(56.11,56.39) 56.11,57.37 arc(55.96,58.14) 55.51,58.8 55.17,59.15 arc(54.73,59.81) 54.57,60.59 摄像头.8
  Inner2 w0.254: U64.41 60.66,49.09 arc(60.38,49.5) 60.29,49.98 60.29,54.9 arc(60.19,55.39) 59.91,55.8 59.69,56.02 arc(59.28,56.29) 58.8,56.39 v1(56.11,56.39)
B28: length 30.6
  Top Layer w0.254: v1(57.11,59.92) 摄像头.10
  Inner2 w0.254: v1(57.11,59.92) 48.31,59.92 arc(47.34,59.73) 46.51,59.18 46.17,58.84 arc(45.62,58.01) 45.43,57.04 45.43,55.71 arc(45.23,54.74) 44.68,53.92 44.02,53.25 arc(43.19,52.7) 42.22,52.51 36.19,52.51 arc(35.22,52.31) 34.4,51.76 U64.46
B29: length 30.7
  Top Layer w0.254: 摄像头.12 v1(59.65,59.95)
  Inner2 w0.254: v1(59.65,59.95) 59.23,59.52 arc(59.02,59.39) 58.78,59.34 48.61,59.34 arc(47.64,59.15) 46.82,58.59 46.68,58.46 arc(46.13,57.63) 45.94,56.66 45.94,55.34 arc(45.74,54.36) 45.19,53.54 44.39,52.74 arc(43.57,52.19) 42.6,52 37.7,52 arc(37.21,51.9) 36.8,51.63 U64.45
B30: length 30.7
  Top Layer w0.254: v1(62.19,59.95) 摄像头.14
  Inner2 w0.254: U64.43 41.16,50.85 arc(43.11,51.24) 44.76,52.34 45.7,53.29 arc(46.25,54.11) 46.44,55.08 46.44,56.93 arc(46.54,57.42) 46.82,57.83 47.47,58.48 arc(47.88,58.76) 48.37,58.86 60.57,58.86 arc(61.06,58.95) 61.47,59.23 v1(62.19,59.95)
B31: length 34.4
  Top Layer w0.254: 摄像头.16 v1(64.73,59.95)
  Inner2 w0.254: U64.44 40.44,48.31 arc(41.41,48.51) 42.24,49.06 46.21,53.03 arc(46.76,53.86) 46.95,54.83 46.95,56.68 arc(47.05,57.16) 47.32,57.58 47.85,58.1 arc(48.26,58.38) 48.75,58.47 62.73,58.47 arc(63.22,58.57) 63.63,58.85 v1(64.73,59.95)
C0: length 89
  Bottom Layer w0.254: 单驱连接.7 75.59,58.15 arc(75.43,57.58) 75.54,57 75.64,56.78 arc(75.75,56.2) 75.59,55.62 74.72,54.11 arc(74.35,53.55) 73.9,53.04 73.28,52.42 arc(72.82,52.06) 72.29,51.81 71.67,51.6 arc(71.36,51.45) 71.11,51.22 70.88,50.96 arc(70.65,50.57) 70.57,50.13 70.57,32.48 arc(70.38,31.5) 69.83,30.68 68.65,29.5 arc(67.83,28.95) 66.85,28.76 42.96,28.76 arc(41.02,28.37) 39.37,27.27 39.3,27.2 arc(38.19,25.55) 37.81,23.6 37.81,7.95 arc(37.71,7.46) 37.44,7.05 37.04,6.65 arc(36.63,6.37) 36.14,6.28 35.16,6.28 arc(34.67,6.18) 34.26,5.91 U64.82
C1: length 78.8
  Bottom Layer w0.254: 73.87,55.23 72.5,53 arc(72.32,52.82) 72.07,52.76 71.34,52.76 arc(70.97,52.7) 70.63,52.54 70.29,52.31 arc(70.13,52.13) 70.07,51.89 70.07,32.98 arc(69.87,32.01) 69.32,31.19 68.27,30.14 arc(67.45,29.58) 66.47,29.39 66.46,29.38 42.79,29.38 arc(40.88,29) 39.26,27.91 38.79,27.45 arc(37.69,25.8) 37.3,23.85 37.3,9.79 arc(37.15,9.01) 36.71,8.35 U64.79
C2: length 63.9
  Top Layer w0.254: U64.80 30.1,7.67 arc(29.12,7.87) 28.3,8.42 28.21,8.51 arc(27.66,9.33) 27.47,10.31 27.47,47.7 arc(27.27,48.67) 26.72,49.49 21.86,54.35 arc(21.73,54.56) 21.68,54.8 v1(21.68,55.3)
  Bottom Layer w0.254: v1(21.68,55.3) 26,57.63 arc(26.33,57.89) 26.55,58.24 26.78,58.75 arc(26.82,58.98) 26.76,59.21 25.61,61.22
C3: length 58
  Top Layer w0.254: U64.77 35.35,10.89 arc(34.7,11.33) 33.92,11.48 31.37,11.48 arc(30.4,11.68) 29.57,12.23 29.28,12.52 arc(28.73,13.35) 28.53,14.32 28.53,49.18 arc(28.34,50.15) 27.79,50.98 23.16,55.6 arc(22.61,56.42) 22.42,57.4 v1(22.42,59.38)
  Bottom Layer w0.254: v1(22.42,59.38) U58.5
C4: length 50.3
  Top Layer w0.254: U64.78 30.99,10.21 arc(30.01,10.41) 29.19,10.96 28.92,11.23 arc(28.37,12.05) 28.18,13.02 28.18,48.64 arc(27.98,49.61) 27.43,50.43 v1(26.29,51.58)
  Bottom Layer w0.254: v1(26.29,51.58) 26.98,52.23 arc(27.1,52.4) 27.14,52.6 27.14,53.07 arc(27.1,53.38) 26.98,53.68 U58.6
C6: length 50.3
  Top Layer w0.254: U64.76 31.62,12.75 arc(30.65,12.95) 29.82,13.5 29.63,13.69 arc(29.08,14.51) 28.89,15.49 28.89,50.31 arc(28.82,50.67) v1(28.61,50.98)
  Bottom Layer w0.254: U58.2 22.59,51.17 arc(23.52,50.22) 24.8,49.88 26.98,49.88 arc(27.47,49.97) 27.88,50.25 v1(28.61,50.98)
C7: length 55.5
  Top Layer w0.254: v1(23.71,57.26) 24.29,57.26 arc(24.77,57.16) 25.19,56.89 29.21,52.86 arc(29.76,52.03) 29.96,51.06 29.96,18.65 arc(30.11,17.88) 30.55,17.22 30.61,17.16 arc(31.27,16.72) 32.05,16.56 33.92,16.56 arc(34.7,16.41) 35.35,15.97 U64.73
  Bottom Layer w0.254: U58.1 19.91,55.88 arc(20.06,55.72) 20.25,55.64 20.48,55.59 arc(20.66,55.59) 20.83,55.65 v1(23.71,57.26)
C8: length 51.7
  Top Layer w0.254: v1(28.61,52.63) 29.07,52.18 arc(29.46,51.59) 29.6,50.89 29.6,17.61 arc(29.76,16.83) 30.2,16.18 30.48,15.89 arc(31.14,15.45) 31.92,15.29 U64.74
  Bottom Layer w0.254: U58.12 34.34,56.19 arc(34.5,55.67) 34.43,55.13 34.29,54.72 arc(34.06,54.34) 33.72,54.05 31.79,52.96 arc(31.18,52.72) 30.54,52.63 v1(28.61,52.63)
C9: length 51
  Top Layer w0.254: U64.71 35.35,18.51 arc(34.7,18.95) 33.92,19.1 31.98,19.1 arc(31.5,19.2) 31.09,19.48 30.69,19.88 arc(30.41,20.29) 30.31,20.78 30.31,51.78 arc(30.16,52.56) 29.72,53.22 29.61,53.33 arc(29.17,53.99) 29.01,54.76 v1(29.01,63.2)
  Bottom Layer w0.254: v1(29.01,63.2) U58.11
C11: length 8
  Top Layer w0.254: RN1.4 RN4.1 41.42,19.94 arc(41.4,19.85) 41.35,19.76 41.18,19.6 arc(41.1,19.55) 41,19.53 37.4,19.53 arc(36.92,19.62) 36.51,19.9 U64.69
C12: length 8.6
  Top Layer w0.254: U64.70 34.26,21.15 arc(34.67,21.42) 35.16,21.52 36.53,21.52 arc(36.77,21.47) 36.98,21.33 37.11,21.2 arc(37.25,20.99) 37.3,20.75 37.3,20.71 arc(37.35,20.46) 37.49,20.26 37.56,20.18 arc(37.77,20.04) 38.01,19.99 38.64,19.99 arc(38.74,20.01) 38.82,20.07 38.95,20.19 arc(39,20.28) 39.02,20.37 39.02,22.01
C13: length 5.4
  Top Layer w0.254: 39.84,22.41 39.84,22.48 arc(39.83,22.53) 39.8,22.57 39.67,22.71 arc(39.59,22.76) 39.49,22.78 36.22,22.78 arc(36.17,22.79) 36.13,22.82 U64.67 ; RN4.3 RN1.2
C14: length 10.2
  Top Layer w0.254: U64.68 34.16,23.59 arc(34.82,24.03) 35.6,24.18 36.52,24.18 arc(37.01,24.09) 37.42,23.81 37.72,23.51 arc(38.13,23.23) 38.62,23.14 40.15,23.14 arc(40.25,23.12) 40.33,23.06 40.53,22.86 arc(40.58,22.78) 40.6,22.68 40.6,22.03 RN1.3 RN4.2
C15: length 13.8
  Top Layer w0.254: R22.1 R23.1 43.02,22.15 43.51,22.15 arc(43.76,22.2) 43.96,22.34 43.97,22.35 arc(44.11,22.55) 44.16,22.8 44.16,24.42 arc(44.06,24.91) 43.79,25.32 43.77,25.34 arc(43.36,25.61) 42.87,25.71 36.39,25.71 arc(36.29,25.69) 36.21,25.63 U64.65
C16: length 48.4
  Top Layer w0.254: U64.66 32.62,25.45 arc(32.13,25.55) 31.72,25.83 31.4,26.15 arc(31.12,26.56) 31.03,27.05 31.03,61.54 arc(30.83,62.51) 30.28,63.33 27.85,65.77 arc(27.79,65.85) 27.78,65.95 27.78,66.3 arc(27.8,66.65) 27.89,66.98 29.09,70.34 arc(29.1,70.44) 29.08,70.53 29.03,70.64
C17: length 45.2
  Top Layer w0.254: 31.42,69.77 31.52,69.56 arc(31.54,69.47) 31.53,69.37 30.58,66.64 arc(30.48,66.23) 30.44,65.81 30.44,65.21 arc(30.49,64.97) 30.63,64.77 31.01,64.38 arc(31.28,63.97) 31.38,63.49 31.38,31.33 arc(31.54,30.55) 31.98,29.89 32.01,29.86 arc(32.67,29.42) 33.44,29.26 33.92,29.26 arc(34.7,29.11) 35.35,28.67 U64.63
C18: length 25
  Top Layer w0.254: v1(19.9,37.65) 屏幕.16
  Bottom Layer w0.254: v1(19.9,37.65) 24.07,37.65 arc(24.56,37.55) 24.97,37.27 24.99,37.26 arc(25.27,36.84) 25.36,36.36 25.36,31.63 arc(25.52,30.85) 25.96,30.19 26.04,30.11 arc(26.7,29.67) 27.47,29.52 29.26,29.52 arc(30.23,29.33) 31.06,28.77 31.47,28.37 arc(31.88,28.09) 32.37,27.99 U64.64
C19: length 31.1
  Top Layer w0.254: v1(14.81,38.35) 14.82,38.36 屏幕.12
  Bottom Layer w0.254: v1(14.81,38.35) 24.51,38.35 arc(25,38.25) 25.41,37.98 25.62,37.76 arc(25.9,37.35) 26,36.87 26,33.35 arc(26.09,32.86) 26.37,32.45 26.77,32.05 arc(27.18,31.77) 27.67,31.68 29.52,31.68 arc(30.49,31.48) 31.31,30.93 32.39,29.85 arc(32.78,29.6) 33.23,29.51 34.47,29.51 arc(34.96,29.6) 35.37,29.88 U64.61
C20: length 14.6
  Bottom Layer w0.254: U64.62 32.08,31.94 arc(31.67,32.22) 31.19,32.31 28.17,32.31 arc(27.69,32.41) 27.28,32.68 27.13,32.83 arc(26.86,33.24) 26.76,33.73 26.76,37.44 arc(26.8,37.63) 26.91,37.8 27.25,38.13 arc(27.41,38.24) 27.6,38.28 29.04,38.28
C21: length 7.8
  Bottom Layer w0.254: U64.59 35.23,33.88 arc(34.57,34.32) 33.79,34.47 33.32,34.47 arc(32.54,34.63) 31.88,35.07 31.8,35.15 arc(31.14,35.59) 30.36,35.74 29.04,35.74
C22: length 4.5
  Bottom Layer w0.254: U64.60 33.36,33.2 29.04,33.2
C23: length 15.3
  Bottom Layer w0.254: U64.57 36.03,35.24 36.83,34.44 arc(37.27,33.78) 37.43,33 37.43,30.55 arc(37.33,30.07) 37.06,29.65 36.8,29.4 arc(36.38,29.12) 35.9,29.02 33.13,29.02 arc(32.16,29.22) 31.34,29.77 30.81,30.29 arc(30.4,30.56) 29.92,30.66 29.04,30.66
C24: length 25.9
  Top Layer w0.254: v1(32.55,55.08) 32.28,54.81 arc(32.14,54.6) 32.09,54.36 32.09,37.85 arc(32.25,37.08) 32.69,36.42 U64.58
  Bottom Layer w0.254: v1(32.55,55.08) 31.44,54.41 arc(30.92,54.19) 30.36,54.12 29.99,54.13 arc(29.74,54.2) 29.56,54.38 U58.8
C28: length 30.4
  Top Layer w0.254: v1(55.67,55.63) 57.01,55.63 摄像头.9
  Inner2 w0.254: v1(55.67,55.63) 51.67,55.63 arc(49.73,55.24) 48.08,54.14 39.19,45.25 arc(38.36,44.7) 37.39,44.5 36.05,44.5 arc(35.56,44.41) 35.15,44.13 35,43.99 arc(34.73,43.58) 34.63,43.09 34.63,42.36 arc(34.54,41.88) 34.26,41.47 U64.54
C29: length 30.5
  Top Layer w0.254: v1(59.65,53.82) 摄像头.11
  Inner2 w0.254: v1(59.65,53.82) 58.93,54.55 arc(58.52,54.82) 58.03,54.92 51.73,54.92 arc(49.9,54.55) 48.34,53.52 38.43,43.61 arc(38.02,43.33) 37.54,43.23 U64.51
C30: length 52.3
  Top Layer w0.254: v1(54.95,49.33) 54.95,50.44 arc(55.15,51.41) 55.7,52.23 55.96,52.5 arc(56.78,53.05) 57.75,53.24 65.3,53.24 arc(66.27,53.43) 67.1,53.98 67.39,54.28 arc(68.22,54.83) 69.19,55.02 71.21,55.02 arc(72.18,55.21) 73.01,55.76 73.07,55.83 arc(73.62,56.65) 73.81,57.62 v1(73.81,59.11)
  Bottom Layer w0.254: v1(73.81,59.11) 73.81,60.64 单驱连接.5 ; v1(54.95,49.33) 54.83,49.2 43.09,49.2 arc(42.32,49.05) 41.66,48.61 41.45,48.4 arc(41.01,47.74) 40.86,46.97 40.86,46.05 arc(40.76,45.56) 40.48,45.15 40.09,44.75 arc(39.67,44.47) 39.19,44.38 35.16,44.38 arc(34.67,44.28) 34.26,44.01 U64.52
C31: length 14.3
  Top Layer w0.254: U64.50 34.26,45 arc(34.67,44.73) 35.16,44.63 43.8,44.63 arc(43.9,44.61) 43.98,44.56 44.2,44.34 arc(44.25,44.26) 44.27,44.16 R11.1 R10.2
CR: length 82
  Top Layer w0.254: R2.2 60.16,14.9 60.15,14.91 ; 47.71,15.32 47.71,16.46 arc(47.73,16.56) 47.79,16.64 47.96,16.81 arc(48.04,16.87) 48.14,16.88 U65.3 ; 47.71,15.32 47.71,13.78 arc(47.76,13.54) 47.9,13.33 47.97,13.26 arc(48.18,13.12) 48.42,13.07 57.75,13.07 arc(58.2,13.26) 58.38,13.71 58.38,14.27 arc(58.43,14.51) 58.57,14.72 58.58,14.73 arc(58.78,14.87) 59.03,14.91 60.15,14.91 ; 47.71,15.32 46.8,15.32 arc(46.56,15.37) 46.36,15.51 45.9,15.97 arc(45.46,16.63) 45.3,17.41 45.3,19.59 arc(45.4,20.08) 45.67,20.49 46.26,21.08 arc(46.46,21.22) 46.71,21.26 46.94,21.26 arc(47.19,21.31) 47.39,21.45 47.4,21.46 arc(47.54,21.66) 47.59,21.91 47.59,22.94 arc(47.61,23.03) 47.66,23.12 47.83,23.29 arc(47.91,23.34) 48.01,23.36 U66.3 ; 60.15,14.91 61.45,14.91 arc(61.55,14.89) 61.63,14.84 61.72,14.75 arc(61.81,14.71) 61.9,14.75 62.13,14.98 arc(62.27,15.19) 62.32,15.43 62.32,25.31 arc(62.42,25.8) 62.69,26.21 63.09,26.61 arc(63.5,26.88) 63.99,26.98 66.49,26.98 arc(66.98,26.88) 67.39,26.61 v1(67.78,26.22) ; U71.4 82.08,47.43 v1(81.12,47.43) ; R1.2 61.81,14.66
  Bottom Layer w0.254: v1(81.12,47.43) 77.41,43.72 arc(76.59,43.17) 75.62,42.98 74.72,42.98 arc(74.53,42.94) 74.36,42.83 74.15,42.62 arc(74.04,42.46) 74,42.26 74,33.02 arc(73.62,31.08) 72.51,29.43 69.68,26.59 arc(69.26,26.31) 68.78,26.22 v1(67.78,26.22)
D0: length 73.8
  Top Layer w0.254: v1(59.78,27.61) v1(59.78,41.71)
  Inner2 w0.254: v1(69.3,59.87) 69.3,43.82 arc(69.15,43.04) 68.71,42.39 68.64,42.32 arc(67.98,41.88) 67.21,41.72 59.79,41.72 v1(59.78,41.71)
  Bottom Layer w0.254: v1(69.3,59.87) 69.3,63.07 单驱连接.1 ; v1(59.78,27.61) 59.78,16.9 arc(59.93,16.12) 60.37,15.46 61.28,14.56 arc(61.94,14.12) 62.72,13.96 66.56,13.96 arc(67.04,14.06) 67.46,14.33 67.53,14.41 arc(67.81,14.82) 67.91,15.31 67.91,17.82 arc(67.81,18.3) 67.53,18.71 67.52,18.73 arc(67.11,19.01) 66.62,19.1 66.08,19.1 arc(65.3,18.95) 64.65,18.51 U64.14
D1: length 27.6
  Top Layer w0.254: U73.1 81.84,31.76 arc(81.6,31.71) 81.39,31.57 81.03,31.21 arc(80.89,31) 80.84,30.76 R14.1 80.81,29.41 R15.1 79.03,29.41 78.51,28.88 arc(78.37,28.67) 78.32,28.43 78.32,24.57 arc(78.27,24.33) 78.13,24.13 77.87,23.86 arc(77.67,23.72) 77.42,23.68 72.05,23.68 arc(71.27,23.52) 70.61,23.08 70.41,22.87 arc(69.97,22.22) 69.81,21.44 69.81,19.38 arc(69.72,18.89) 69.44,18.48 69.17,18.21 arc(68.76,17.93) 68.27,17.83 U64.13
D2: length 53.4
  Bottom Layer w0.254: U64.12 62.68,16.58 arc(62.13,17.41) 61.94,18.38 61.94,25.04 arc(62.13,26.01) 62.68,26.83 62.72,26.87 arc(63.54,27.42) 64.51,27.61 66.82,27.61 arc(68.76,28) 70.41,29.1 70.56,29.25 arc(71.66,30.9) 72.05,32.84 72.05,46.23 arc(72.18,46.96) 72.57,47.59 72.87,47.92 arc(73.14,48.14) 73.46,48.29 73.81,48.39 arc(73.98,48.47) 74.11,48.62 77.57,54.54 arc(78.04,55) 78.67,55.17 78.89,55.17 arc(79.5,55.33) 79.96,55.77 单驱连接.11
D3: length 48.8
  Bottom Layer w0.254: U64.11 65.84,15.97 arc(65.18,16.41) 64.4,16.56 63.67,16.56 arc(63.48,16.6) 63.31,16.71 62.94,17.08 arc(62.67,17.49) 62.57,17.98 62.57,25.31 arc(62.67,25.8) 62.94,26.21 63.34,26.61 arc(63.76,26.88) 64.24,26.98 67.07,26.98 arc(69.02,27.37) 70.66,28.47 71.28,29.08 arc(72.38,30.73) 72.77,32.67 72.77,45.43 arc(72.97,46.31) 73.54,47.02 74.65,47.9 arc(75,48.2) 75.33,48.54 76.49,49.87 arc(76.78,50.23) 77.03,50.62 单驱连接.12
D16: length 40.9
  Top Layer w0.254: v1(93.05,47.93) 93.05,48.94 无线串口.1
  Bottom Layer w0.254: v1(93.05,47.93) 91.13,46.01 arc(90.31,45.46) 89.33,45.27 82.71,45.27 arc(80.77,44.88) 79.12,43.78 76.89,41.55 arc(75.79,39.9) 75.4,37.96 75.4,33.78 arc(75.01,31.84) 73.91,30.19 69.92,26.2 arc(69.1,25.65) 68.12,25.45 U64.19
D17: length 43.7
  Top Layer w0.254: v1(93.05,45.14) 93.05,46.4 无线串口.3
  Bottom Layer w0.254: U64.20 65.34,24.08 arc(65.51,23.97) 65.7,23.93 66.07,23.93 66.08,23.94 66.94,23.94 66.95,23.93 67.89,23.93 arc(68.38,24.03) 68.79,24.3 74.67,30.19 arc(75.78,31.84) 76.16,33.78 76.16,37.57 arc(76.55,39.52) 77.65,41.17 79.5,43.02 arc(81.15,44.12) 83.09,44.5 92.21,44.5 arc(92.4,44.54) 92.57,44.65 v1(93.05,45.14)
D26: length 102.2
  Top Layer w0.254: 无线串口.4 97.87,45.38 v1(97.56,45.08)
  Bottom Layer w0.254: U64.84 34.4,1.69 arc(35.22,1.14) 36.19,0.94 69.17,0.94 arc(70.82,1.27) 72.22,2.21 arc(73.16,3.61) 73.49,5.27 73.49,24.36 arc(73.87,26.3) 74.97,27.95 76.83,29.81 arc(77.93,31.46) 78.32,33.4 78.32,35.8 arc(78.71,37.74) 79.81,39.39 80.33,39.91 arc(81.97,41.01) 83.92,41.39 96.72,41.39 arc(96.91,41.43) 97.08,41.54 97.41,41.88 arc(97.52,42.04) 97.56,42.24 v1(97.56,45.08)
D27: length 101.4
  Top Layer w0.254: 无线串口.8 97.81,41.28 96.29,41.28 arc(96.05,41.33) 95.84,41.46 95.78,41.52 arc(95.64,41.73) 95.59,41.97 v1(95.59,42.6) ; U64.81 37.67,5.13 arc(37.91,5.18) 38.12,5.32 38.39,5.59 arc(38.53,5.8) 38.58,6.04 R9.1
  Bottom Layer w0.254: U64.81 38.11,3.05 arc(39.76,1.95) 41.7,1.57 67.83,1.57 arc(69.65,1.93) 71.19,2.96 arc(72.14,4.38) 72.48,6.06 72.48,24.24 arc(72.87,26.18) 73.97,27.83 76.07,29.94 arc(77.17,31.58) 77.56,33.53 77.56,36.43 arc(77.95,38.38) 79.05,40.02 80.13,41.11 arc(81.78,42.21) 83.73,42.6 v1(95.59,42.6)
$1N21001: length 2.8
  Top Layer w0.254: R3.2 54.57,53.66 摄像头.7
$3N1397: length 6.8
  Top Layer w0.254: R2.1 R1.1 64.85,11.62 arc(65.34,11.72) 65.75,11.99 U64.9
$3N1900: length 1.9
  Top Layer w0.254: R8.2 80.11,47.36 U71.3
$3N2786: length 13.8
  Top Layer w0.254: BUZZER2.1 47.26,29.98 arc(47.02,30.03) 46.81,30.17 46.5,30.48 arc(46.37,30.68) 46.32,30.92 46.32,39.16 arc(46.27,39.4) 46.13,39.61 45.85,39.89 arc(45.65,40.03) 45.4,40.08 R12.2
$3N2792: length 3.6
  Top Layer w0.254: BUZZER2.2 48.95,37.23 arc(48.97,37.27) 48.98,37.32 48.98,38.65 arc(48.94,38.9) 48.8,39.1 48.49,39.41 arc(48.29,39.54) 48.04,39.59 Q1.3
$3N2800: length 2.1
  Top Layer w0.254: Q1.1 48.28,43.43 R10.1
$3N3700: length 51.4
  Top Layer w0.254: v1(68.29,6.57) 72.4,6.57 arc(73.37,6.38) 74.2,5.83 74.47,5.56 arc(75.29,5.01) 76.26,4.82 SW5.6 ; v1(43.14,8.06) 43.01,8.18 R22.2
  Bottom Layer w0.254: v1(43.14,8.06) 43.4,7.8 60.52,7.8 arc(61.01,7.7) 61.42,7.43 61.83,7.02 arc(62.24,6.74) 62.73,6.65 68.22,6.65 v1(68.29,6.57)
$3N3710: length 41.3
  Top Layer w0.254: v1(41.36,8) 41.42,8.06 RN4.8 ; SW5.3 v1(68.16,4.82)
  Bottom Layer w0.254: v1(68.16,4.82) 68.16,5.31 arc(68.12,5.5) 68.01,5.66 67.77,5.91 arc(67.36,6.18) 66.87,6.28 61.83,6.28 arc(61.34,6.37) 60.93,6.65 60.79,6.79 arc(60.37,7.07) 59.89,7.17 42.73,7.17 arc(42.29,7.25) 41.9,7.47 41.9,7.47 v1(41.36,8)
$3N3730: length 51.8
  Top Layer w0.254: SW5.5 75.03,8.5 arc(74.26,8.65) 73.6,9.09 73.46,9.24 arc(72.8,9.68) 72.02,9.83 v1(68.16,9.83) ; RN4.7 40.62,9.81 v1(40.73,9.71)
  Bottom Layer w0.254: v1(68.16,9.83) 67.66,9.33 arc(67.5,9.22) 67.3,9.19 41.46,9.19 arc(41.27,9.22) 41.1,9.33 v1(40.73,9.71)
$3N3739: length 52.5
  Top Layer w0.254: v1(39.79,10.47) 39.82,10.5 RN4.6 ; SW5.4 76.75,11.29 arc(76.27,11.39) 75.85,11.67 75.57,11.95 arc(75.16,12.23) 74.67,12.32 68.21,12.32 v1(68.16,12.37)
  Bottom Layer w0.254: v1(68.16,12.37) 67.52,11.73 arc(67.1,11.45) 66.62,11.36 64.17,11.36 arc(63.2,11.16) 62.38,10.61 62.12,10.36 arc(61.54,9.97) 60.85,9.83 43.35,9.83 arc(43.16,9.87) 42.99,9.98 42.66,10.32 arc(42.49,10.43) 42.3,10.47 v1(39.79,10.47)
$3N3749: length 41.5
  Top Layer w0.254: v1(38.95,8.82) 39.02,8.89 39.02,18.84 ; SW5.2 70,8.77 v1(68.54,8.77)
  Bottom Layer w0.254: v1(38.95,8.82) 39,8.77 v1(68.54,8.77)
$4N2636: length 1.5
  Top Layer w0.254: LED1.2 94.57,37.77 R5.1
$4N2685: length 1.5
  Top Layer w0.254: R4.1 96.06,36 LED2.2
$4N2734: length 1.5
  Top Layer w0.254: 94.57,32.56 94.57,32.57 ; LED3.2 94.57,32.44
$4N2783: length 1.5
  Top Layer w0.254: R7.1 96.06,34.22 LED4.2
$5N459: length 11.1
  Top Layer w0.254: R13.2 81.87,25.59 arc(82.35,25.69) 82.76,25.96 82.98,26.17 arc(83.25,26.58) 83.35,27.07 83.35,30.22 arc(83.4,30.46) 83.53,30.67 83.66,30.79 arc(83.94,30.98) 84.26,31.04 arc(84.37,31.06) 84.46,31.13 84.61,31.28 arc(84.75,31.48) 84.8,31.73 84.8,31.95 arc(84.78,32.05) 84.72,32.13 84.52,32.34 arc(84.44,32.39) 84.34,32.41 U73.2
$5N464: length 1.8
  Top Layer w0.254: 79.06,27.9 79.31,27.65 LED5.1
$5N467: length 3.7
  Top Layer w0.254: U73.13 79.16,32.41 79.29,32.28 79.29,31.94 79.16,31.81 77.73,31.81 U73.14
$5N1031: length 13.2
  Top Layer w0.254: R16.2 85.19,25.59 arc(84.7,25.69) 84.29,25.96 84.08,26.18 arc(83.8,26.59) 83.7,27.07 83.7,29.87 arc(83.77,30.2) 83.96,30.48 arc(84.16,30.61) 84.4,30.66 arc(84.65,30.71) 84.86,30.85 85.12,31.11 arc(85.26,31.32) 85.31,31.56 85.31,33.56 arc(85.21,34.05) 84.93,34.46 84.76,34.64 arc(84.34,34.91) 83.86,35.01 U73.6
$5N1036: length 1.8
  Top Layer w0.254: 84.52,27.9 84.77,27.65 LED6.1
$5N1349: length 13.9
  Top Layer w0.254: U73.9 76.71,35.01 arc(76.47,34.96) 76.26,34.82 76.22,34.78 arc(76.08,34.58) 76.03,34.34 76.03,32.31 arc(76.17,31.61) 76.57,31.01 77.52,30.06 arc(77.74,29.74) 77.81,29.36 77.81,26.35 arc(77.76,26.11) 77.63,25.9 77.5,25.78 arc(77.29,25.64) 77.05,25.59 R19.2
$5N1354: length 1.9
  Top Layer w0.254: 73.53,27.83 73.71,27.65 LED7.1

## Copper pours and planes (outline as drawn; the poured copper is in the pictures)
